# EAGLE design Aystable (EAGLE 7.5.0)
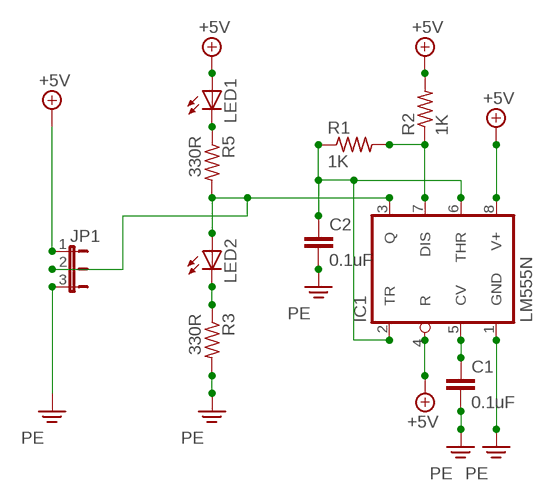
[diagram p0: schematic, sheet 1]

## Parts
C1  0.1uF  C-EU075-032X103  [C075-032X103]
C2  0.1uF  C-EU075-032X103  [C075-032X103]
IC1  LM555N  [DIL08]
JP1  JP2E  [JP2]
LED1  LED5MM  [LED5MM]
LED2  LED5MM  [LED5MM]
R1  1K  R-US_0207/10  [0207/10]
R2  1K  R-US_0207/10  [0207/10]
R3  330R  R-US_0207/10  [0207/10]
R5  330R  R-US_0207/10  [0207/10]

## Nets
+5V: IC1.4(R) IC1.8(V+) JP1.1 LED1.A R2.2
N$1: IC1.3(Q) JP1.2 LED2.A R5.2
N$2: C2.1 IC1.2(TR) IC1.6(THR) R1.1
N$3: C1.1 IC1.5(CV)
N$4: IC1.7(DIS) R1.2 R2.1
N$5: LED1.K(C) R5.1
N$6: LED2.K(C) R3.1
PE: C1.2 C2.2 IC1.1(GND) JP1.3 R3.2

## Library data of the parts
C1 C2 = rcl:C-EU: CAPACITOR, European symbol
IC1 = linear:*555: TIMER
JP1 = jumper:JP2E: JUMPER
LED1 LED2 = led:LED: LED OSRAM: - CHIPLED LG R971, LG N971, LY N971, LG Q971, LY Q971, LO R971, LY R971 LH N974, LH R974 LS Q976, LO Q976, LY Q976 LO Q996 - Hyper CHIPLED LW Q18S LB Q993, LB Q99A, LB R99A - SideLED LS A670, LO A670, LY A670, LG A670, LP A670 LB A673, LV A673, LT A673, LW A673 LH A674 LY A675 LS A676, LA A676, LO A676, LY A676, LW A676 LS A679, LY A679, LG A679 - Hyper Micro SIDELED® LS Y876, LA Y876, LO Y876, LY Y876 LT Y87S - SmartLED LW L88C, LW L88S LB L89C, LB L89S, LG L890 LS L89K, LO L89K, LY L89K LS L896, LA L896, LO L896, LY L896 - TOPLED LS T670, LO T670, LY T670, LG T670, LP T670 LSG T670, LSP T670, LSY T670, LOP T670, LYG T670 LG T671, LOG T671, LSG T671 LB T673, LV T673, LT T673, LW T673 LH T674 LS T676, LA T676, LO T676, LY T676, LB T676, LH T676, LSB T676, LW T676 LB T67C, LV T67C, LT T67C, LS T67K, LO T67K, LY T67K, LW E67C LS E67B, LA E67B, LO E67B, LY E67B, LB E67C, LV E67C, LT E67C LW T67C LS T679, LY T679, LG T679 LS T770, LO T770, LY T770, LG T770, LP T770 LB T773, LV T773, LT T773, LW T773 LH T774 LS E675, LA E675, LY E675, LS T675 LS T776, LA T776, LO T776, LY T776, LB T776 LHGB T686 LT T68C, LB T68C - Hyper Mini TOPLED® LB M676 - Mini TOPLED Santana® LG M470 LS M47K, LO M47K, LY M47K Source: http://www.osram.convergy.de LUXEON: - LUMILED® LXK2-PW12-R00, LXK2-PW12-S00, LXK2-PW14-U00, LXK2-PW14-V00 LXK2-PM12-R00, LXK2-PM12-S00, LXK2-PM14-U00 LXK2-PE12-Q00, LXK2-PE12-R00, LXK2-PE12-S00, LXK2-PE14-T00, LXK2-PE14-U00 LXK2-PB12-K00, LXK2-PB12-L00, LXK2-PB12-M00, LXK2-PB14-N00, LXK2-PB14-P00, LXK2-PB14-Q00 LXK2-PR12-L00, LXK2-PR12-M00, LXK2-PR14-Q00, LXK2-PR14-R00 LXK2-PD12-Q00, LXK2-PD12-R00, LXK2-PD12-S00 LXK2-PH12-R00, LXK2-PH12-S00 LXK2-PL12-P00, LXK2-PL12-Q00, LXK2-PL12-R00 Source: www.luxeon.com KINGBRIGHT: KA-3528ASYC Source: www.kingbright.com
R1-R3 R5 = resistor:R-US_: RESISTOR, American symbol

## Board
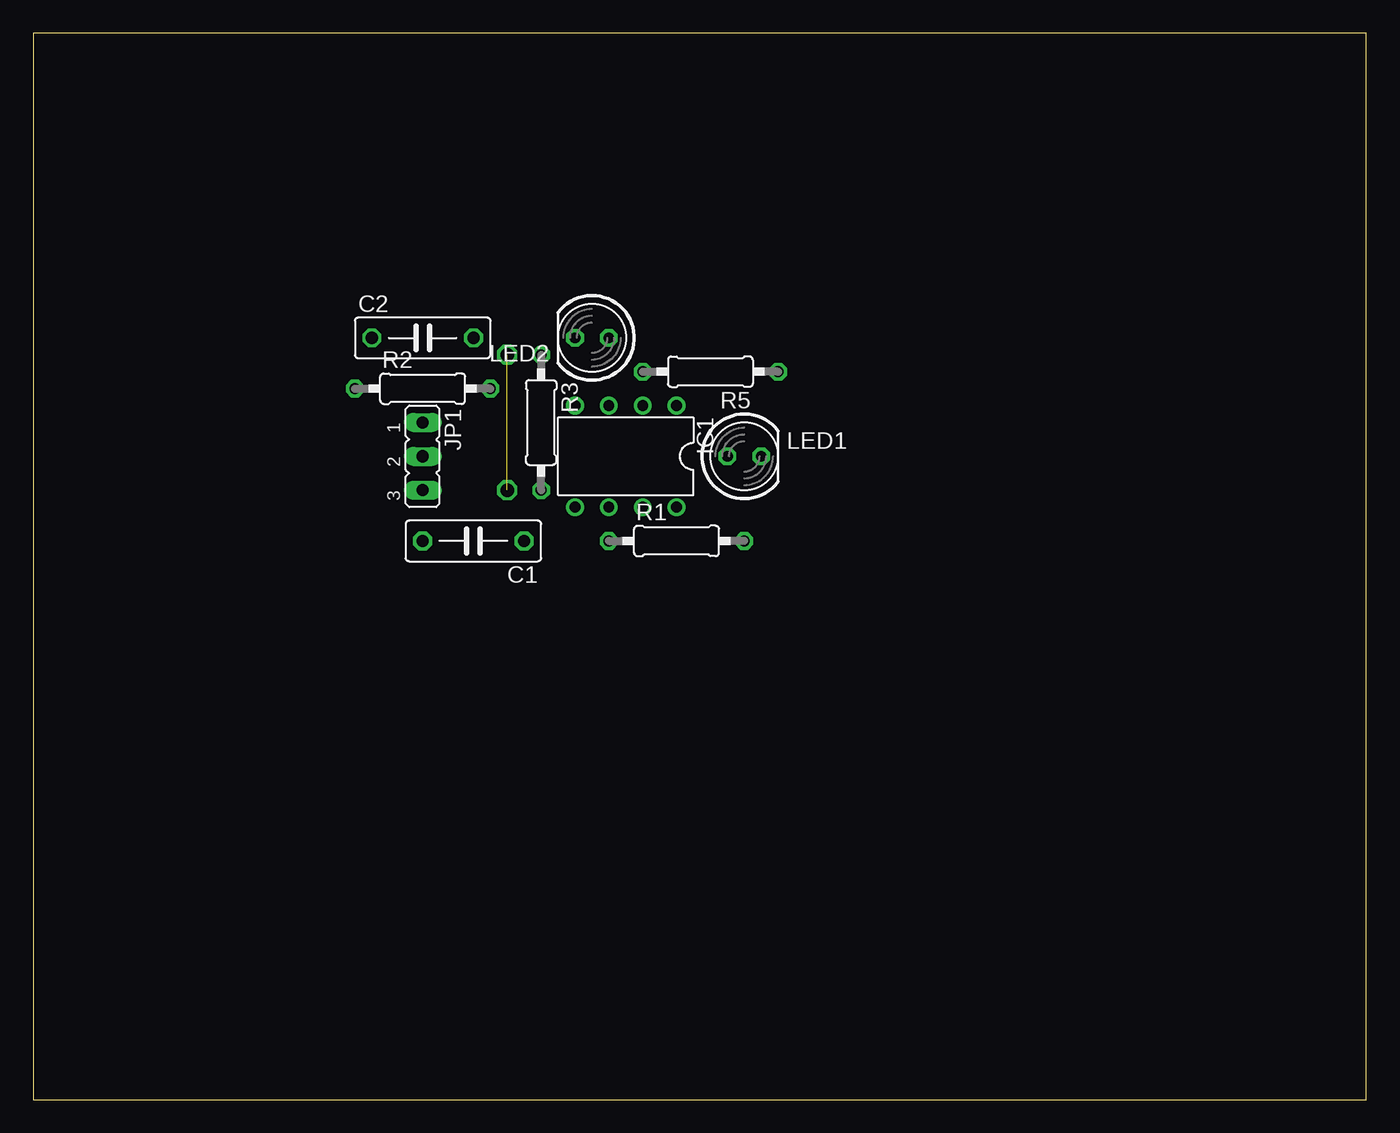
[diagram p1: board, top side]
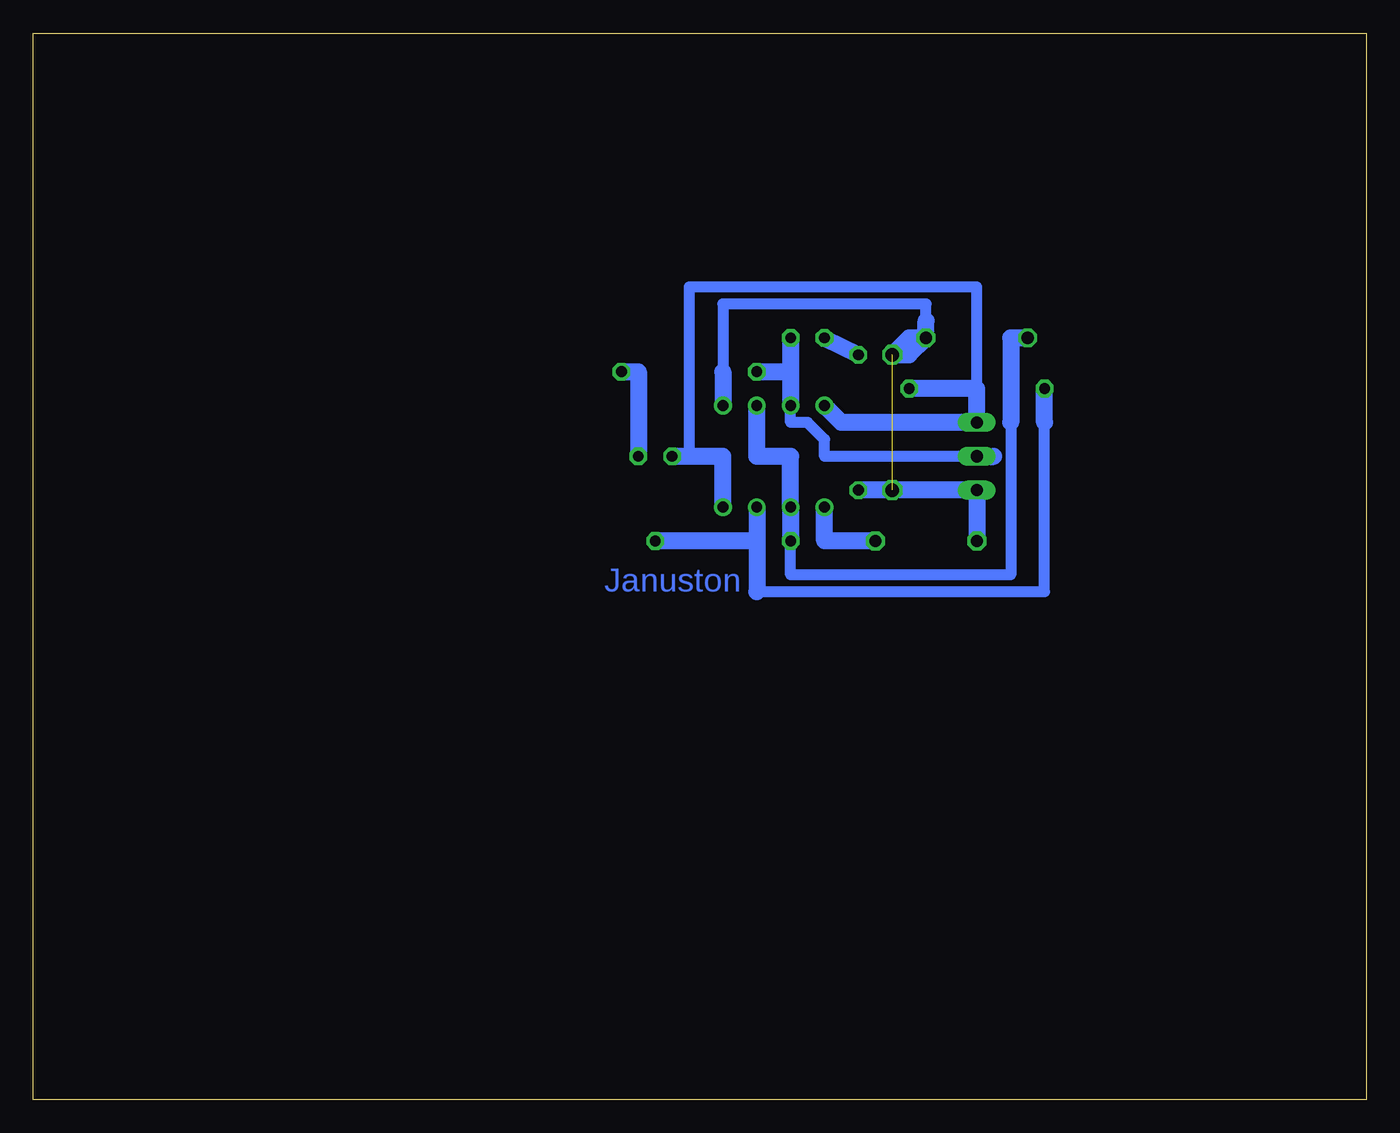
[diagram p2: board, bottom side, seen from below]

Size 100 x 80 mm. Coordinates in mm from the lower left corner, seen from the top.
Outline: 0,0 100,0 100,80 0,80 0,0
Copper layers (1*16): Top 0.035mm / dielectric 1.5mm / Bottom 0.035mm
Design rules "default": minimum track width 10mil, minimum drill 24mil, track to track 8mil, track to pad 8mil, pad to pad 8mil, via to via 8mil, smd to smd 8mil, copper to edge 40mil, drill to drill 8mil, minimum pad ring 10mil, minimum via ring 8mil, stop-mask expansion 4mil, vias tented up to drill 0mil, thermal gap 10mil

### Footprints (pad centres in the part's own frame; a part is rotated, then mirrored left to right if it is on the bottom)
C075-032X103 = drill 0.914 octagon: 1 -3.81,0; 2 3.81,0
DIL08 = drill 0.813 pad 1.27: 1 -3.81,-3.81; 2 -1.27,-3.81; 3 1.27,-3.81; 4 3.81,-3.81; 5 3.81,3.81; 6 1.27,3.81; 7 -1.27,3.81; 8 -3.81,3.81
JP2 = drill 0.914 long: 1 -2.54,0; 2 0,0; 3 2.54,0
LED5MM = drill 0.813 octagon: A -1.27,0; K 1.27,0
0207/10 = drill 0.813 octagon: 1 -5.08,0; 2 5.08,0

### Placement (x,y rotation side)
C1  33.02,41.91 180 top
C2  29.21,57.15 0 top
IC1  44.45,48.26 180 top
JP1  29.21,48.26 270 top
LED1  53.34,48.26 0 top
LED2  41.91,57.15 180 top
R1  48.26,41.91 0 top
R2  29.21,53.34 0 top
R3  38.1,50.8 270 top
R5  50.8,54.61 180 top

### Tracks (layer width: path | path; a pad name or v marks a point on that pad's centre or on a via)
+5V
  Bottom 0.813: 29.21,53.34 29.21,60.96 50.8,60.96 50.8,48.26
  Bottom 1.27: IC1.8 48.26,48.26 50.8,48.26 LED1.A | R2.2 29.21,53.34 JP1.1 39.37,50.8 IC1.4
N$1
  Bottom 0.813: 27.94,48.26 40.64,48.26 40.64,49.53 41.91,50.8 43.18,50.8 IC1.3
  Bottom 1.27: LED2.A 43.18,54.61 | 43.18,54.61 IC1.3 | R5.2 43.18,54.61 | JP1.2 27.94,48.26
N$2
  Bottom 0.813: 26.67,50.8 26.67,39.37 43.18,39.37 R1.1
  Bottom 1.27: IC1.2 45.72,48.26 43.18,48.26 IC1.6 R1.1 | C2.1 26.67,57.15 26.67,50.8
N$3
  Bottom 1.27: C1.1 40.64,41.91 IC1.5
N$4
  Bottom 0.813: 24.13,50.8 24.13,38.1 45.72,38.1
  Bottom 1.27: IC1.7 45.72,41.91 | 45.72,41.91 R1.2 | 45.72,41.91 45.72,38.1 | 24.13,50.8 R2.1
N$5
  Bottom 1.27: R5.1 54.61,54.61 LED1.K
N$6
  Bottom 1.27: LED2.K R3.1
PE  (via drill 1)  (1 unrouted)
  Bottom 0.813: 33.02,58.42 33.02,59.69 48.26,59.69 48.26,54.61
  Bottom 1.27: R3.2 v35.56,45.72 JP1.3 C1.2 | C2.2 34.29,57.15 v35.56,55.88 34.29,55.88 C2.2 | C2.2 33.02,58.42 | 48.26,54.61 IC1.1

### Text on the board
Bottom: Januston